# Altium schematic sheet POWER.SchDoc
size 420 x 297 mm; SheetNumber: 7; SheetTotal: 8
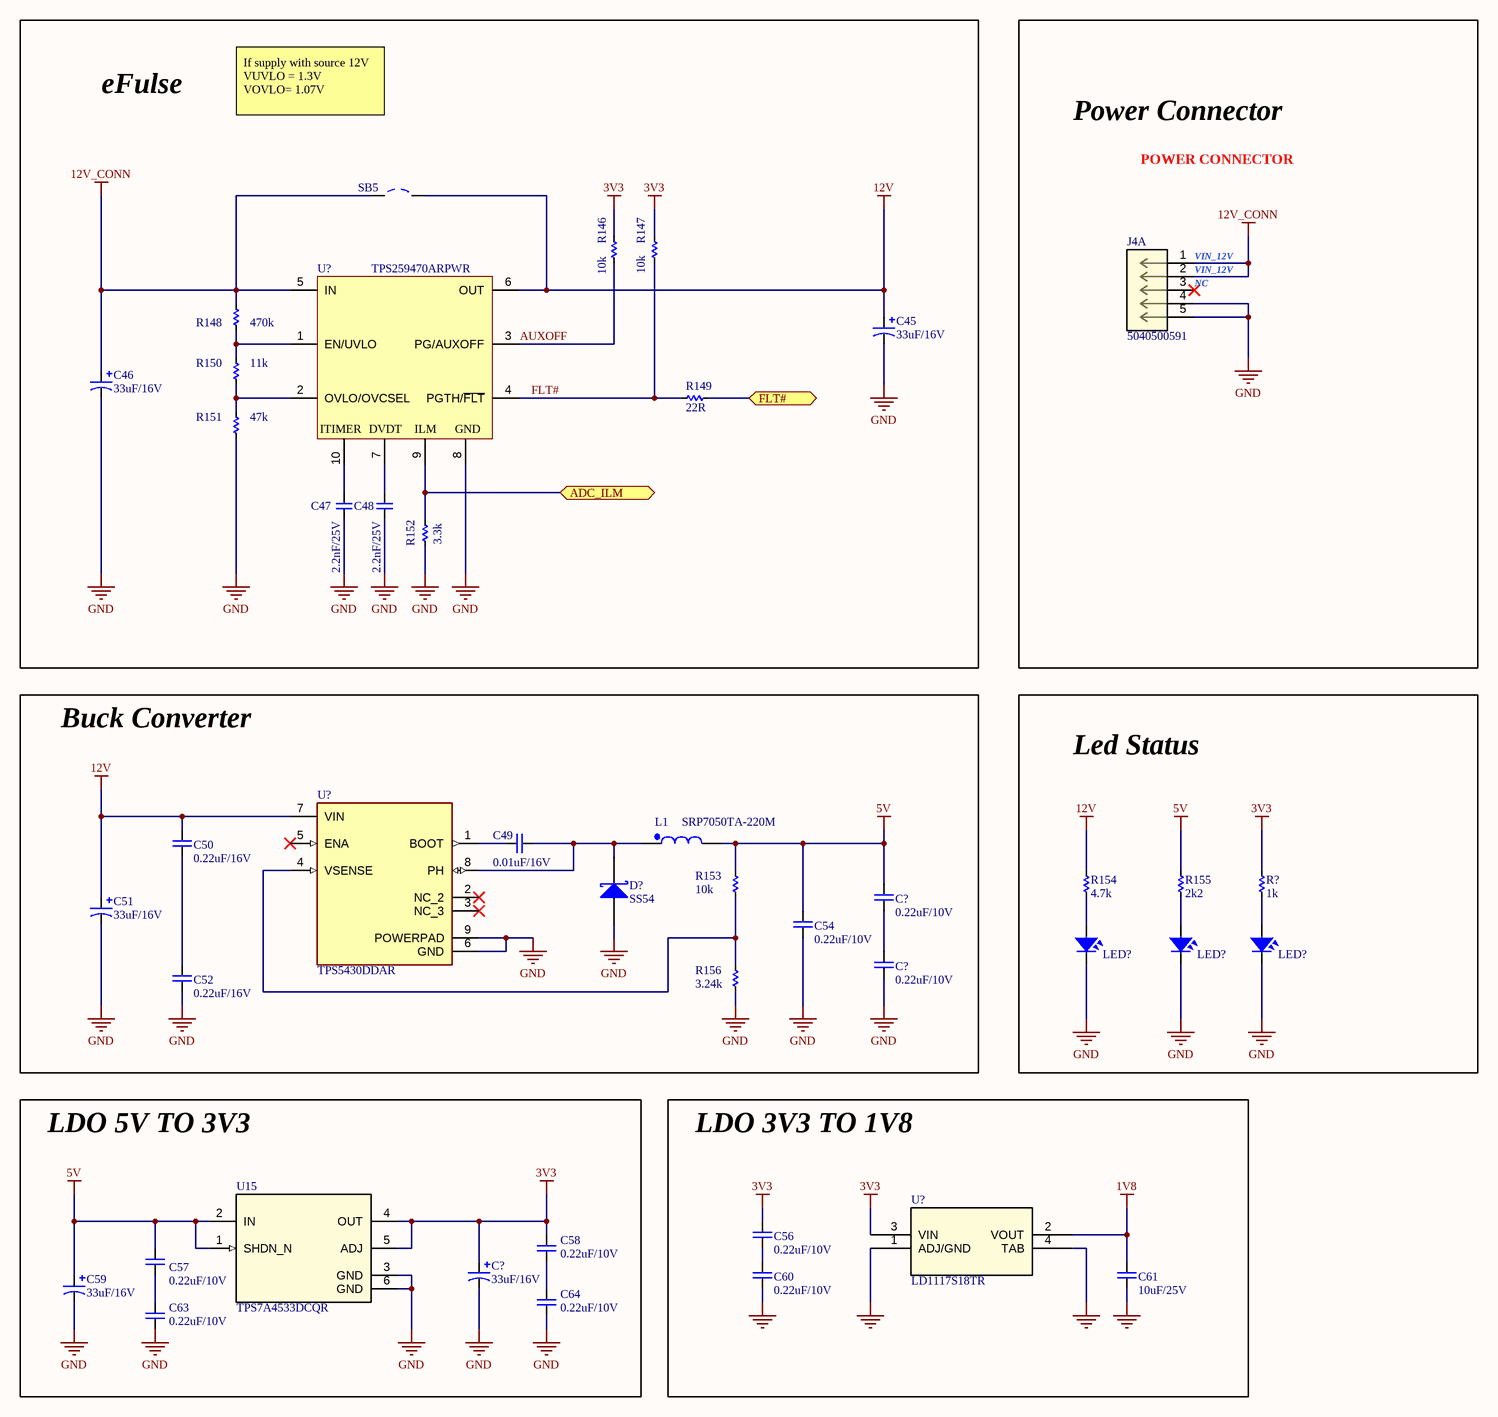
[diagram p0: POWER.SchDoc]

## Parts
(Parts that share a designator on the sheet are numbered #1, #2 ... from top to bottom, then left to right.)
C45  33uF/16V  [CAP_MP_1608X90]
C46  33uF/16V  [CAP_MP_1608X90]
C47  2.2nF/25V  [CAP_C_1608X80]
C48  2.2nF/25V  [CAP_C_1608X80]
C49  0.01uF/16V  [CAP_C_1608X80]
C50  0.22uF/16V  [CAP_C_1608X80_L]
C51  33uF/16V  [CAP_MP_1608X90]
C52  0.22uF/16V  [CAP_C_1608X80_L]
C54  0.22uF/10V  [CAP_C_1608X80]
C56  0.22uF/10V  [CAP_C_1608X80]
C57  0.22uF/10V  [CAP_C_1608X80]
C58  0.22uF/10V  [CAP_C_1608X80]
C59  33uF/16V  [CAP_MP_1608X90]
C60  0.22uF/10V  [CAP_C_1608X80]
C61  10uF/25V  [CAP_C_1608X80_L]
C63  0.22uF/10V  [CAP_C_1608X80]
C64  0.22uF/10V  [CAP_C_1608X80]
C?#1  0.22uF/10V  [CAP_C_1608X80]
C?#2  0.22uF/10V  [CAP_C_1608X80]
C?#3  33uF/16V  [CAP_MP_1608X90]
D?  SS54  [DO-214AC_SMA]
J4  5040500591  [CONN_5040500591_MOL]  (part A of 2)
L1  SRP7050TA-220M  [SRP7050TA-220M]
LED?#1  LED  [LED_0603]  (value not drawn)
LED?#2  LED  [LED_0603]  (value not drawn)
LED?#3  LED  [LED_0603]  (value not drawn)
R146  10k  [RES_C_1608X60]
R147  10k  [RES_C_1608X60]
R148  470k  [RES_C_1608X60]
R149  22R  [RES_C_1608X60]
R150  11k  [RES_C_1608X60]
R151  47k  [RES_C_1608X60]
R152  3.3k  [RES_C_1608X60]
R153  10k  [RES_C_1608X60]
R154  4.7k  [RES_C_1608X60]
R155  2k2  [RES_C_1608X60]
R156  3.24k  [RES_C_1608X60]
R?  1k  [RES_C_1608X60]
SB5  Solder Bridge OFF  [Jump2]  (value not drawn)
U15  TPS7A4533DCQR  [DCQ0006A-MFG]
U?#1  TPS259470ARPWR  [VQFN-HR-10]
U?#2  TPS5430DDAR  [CONV_TPS5430DDAR]
U?#3  LD1117S18TR  [SOT-223_STM]

## Blocks framed on the sheet
eFulse: C45-C48 R146-R152 SB5 U?#1
Power Connector: J4
Buck Converter: C49-C52 C54 C?#1 C?#2 D? L1 R153 R156 U?#2
Led Status: LED?#1-LED?#3 R154 R155 R?
LDO 5V TO 3V3: C57-C59 C63 C64 C?#3 U15
LDO 3V3 TO 1V8: C56 C60 C61 U?#3

## Ports
ADC_ILM (bidir), FLT# (bidir)

## Nets
1V8: C61.2 U?#3.2(VOUT)
3V3: C56.2 C58.2 C?#3.1 R146.2 R147.2 R?.2 U15.4(OUT) U15.5(ADJ) U?#3.3(VIN)
5V: C54.2 C57.2 C59.1 C?#1.2 L1.2 R153.1 R155.2 U15.1(SHDN_N) U15.2(IN)
12V: C45.1 C50.2 C51.1 R154.2 SB5.2 U?#1.6(OUT) U?#2.7(VIN)
12V_CONN: C46.1 J4.1 J4.2 R148.1 SB5.1 U?#1.5(IN)
GND: C45.2 C46.2 C47.1 C48.1 C51.2 C52.1 C54.1 C59.2 C60.1 C61.1 C63.1 C64.1 C?#2.1 C?#3.2 D?.1(A) J4.4 J4.5 LED?#1.2 LED?#2.2 LED?#3.2 R151.2 R152.2 R156.2 U15.3(GND) U15.6(GND) U?#1.8(GND) U?#2.6(GND) U?#2.9(POWERPAD) U?#3.1(ADJ/GND) U?#3.4(TAB)
ADC_ILM: R152.1 U?#1.9(ILM) ; port ADC_ILM
AUXOFF: R146.1 U?#1.3(PG/AUXOFF)
FLT#: R147.1 R149.1 U?#1.4(PGTH/~{FLT})
FLT#: R149.2 ; port FLT#  [a separate net that carries the same name]
NetC47_2: C47.2 U?#1.10(ITIMER)
NetC48_2: C48.2 U?#1.7(DVDT)
NetC49_1: C49.1 D?.2(K) L1.1 U?#2.8(PH)
NetC49_2: C49.2 U?#2.1(BOOT)
NetC50_1: C50.1 C52.2
NetC56_1: C56.1 C60.2
NetC57_1: C57.1 C63.2
NetC58_1: C58.1 C64.2
NetC?#1_1: C?#1.1 C?#2.2
NetLED?#1_1: LED?#1.1 R154.1
NetLED?#2_1: LED?#2.1 R155.1
NetLED?#3_1: LED?#3.1 R?.1
NetR148_2: R148.2 R150.1 U?#1.1(EN/UVLO)
NetR150_2: R150.2 R151.1 U?#1.2(OVLO/OVCSEL)
NetR153_2: R153.2 R156.1 U?#2.4(VSENSE)

Not connected (* = marked no-connect by the designer): J4 3*; U?#2 2(NC_2)* 3(NC_3)* 5(ENA)*

## Notes on the sheet
- If supply with source 12V
  VUVLO = 1.3V
  VOVLO= 1.07V
- POWER CONNECTOR
- (near J4) VIN_12V
- (near J4) NC
- Sub-system:
- Design by:
- Sheet title:
- Project:
- Sheet:
- of
- Checked by:
- Approved by:
- Doc no:
- Revision:
- Size:
- Date:

## Library data of the parts
C45 C46 C51 C59 C?#3 = _CAP_Pola_2: CAP Polarization
C47 C48 = _CAP_C_2: CAP CHIP
C49 C50 C52 C54 C56-C58 C60 C61 C63 C64 C?#1 C?#2 = CAP_SMD: CAP_Chip; Value: 33pF
D? = SS54: DIODE SCHOTTKY 40V 5A SMA; MPN: SS34; Solder: SMT; Value: SS34; MFR: *
J4 = 5040500591: 1.50mm Pitch, Pico-Lock PCB Header, Single Row, Right-Angle, Surface Mount, Gold (Au) Plating, Positive Lock, 5 Circuits, Tape and Reel; Manufacturer_Name: Molex Connector Corporation; Copyright: Copyright (C) 2025 Ultra Librarian. All rights reserved.; Manufacturer_Part_Number: 5040500591; RefDes: RefDes; Type: Type
L1 = _IND: FIXED IND 22UH 2.5A 170 MOHM SMD
LED?#1-LED?#3 = LED SMD: Value: LED 3 - 5 ly 2 Colour
R146-R153 R156 = _RES_B_2: RES
R154 = _RES_B_2: RES, 470R. 0603
R155 R? = _RES_B_2: RES, 47R. 0603
SB5 = SB_OFF: Fitted: NO; Ordered by: Subcon; Revision: July-2002: Re-released for DXP Platform.; ECCN_US/EU: n/a
U15 = TPS7A4533DCQR: 1.5-A, 20-V, ultra-low-dropout voltage regulator with reverse current protection & enable 6-SOT-223 -40 to 125; Manufacturer_Name: Texas Instruments; TYPE: TYPE; RefDes: RefDes; Copyright: Copyright (C) 2025 Ultra Librarian. All rights reserved.; Manufacturer_Part_Number: TPS7A4533DCQR; Datasheet: https://www.ti.com/lit/gpn/tps7a45
U?#2 = TPS5430DDAR: 5.5V to 36V Input, 3A, 500kHz Step-Down Converter; MF: Texas Instruments; Package: HSOIC-8 Texas Instruments; Check_prices: https://www.snapeda.com/parts/TPS5430DDAR/Texas+Instruments/view-part/?ref=eda; Value: *; Purchase-URL: https://pricing.snapeda.com/search/part/TPS5430DDAR/?ref=eda; Availability: In Stock; SnapEDA_Link: https://www.snapeda.com/parts/TPS5430DDAR/Texas+Instruments/view-part/?ref=snap; MP: TPS5430DDAR; Price: None
U?#3 = LD1117S18TR: Adjustable and fixed low drop positive voltage regulator; Manufacturer_Name: STMicroelectronics; Copyright: Copyright (C) 2025 Ultra Librarian. All rights reserved.; Manufacturer_Part_Number: LD1117S18TR; Datasheet: https://www.st.com/resource/en/datasheet/ld1117.pdf; RefDes: RefDes; Type: Type